# EAGLE design smartFridgeController (EAGLE 9.0.1)
CNAME: Smat Fridge Controller; CREVISION: 0.4; DESIGNER: greg.cope@gmail.com
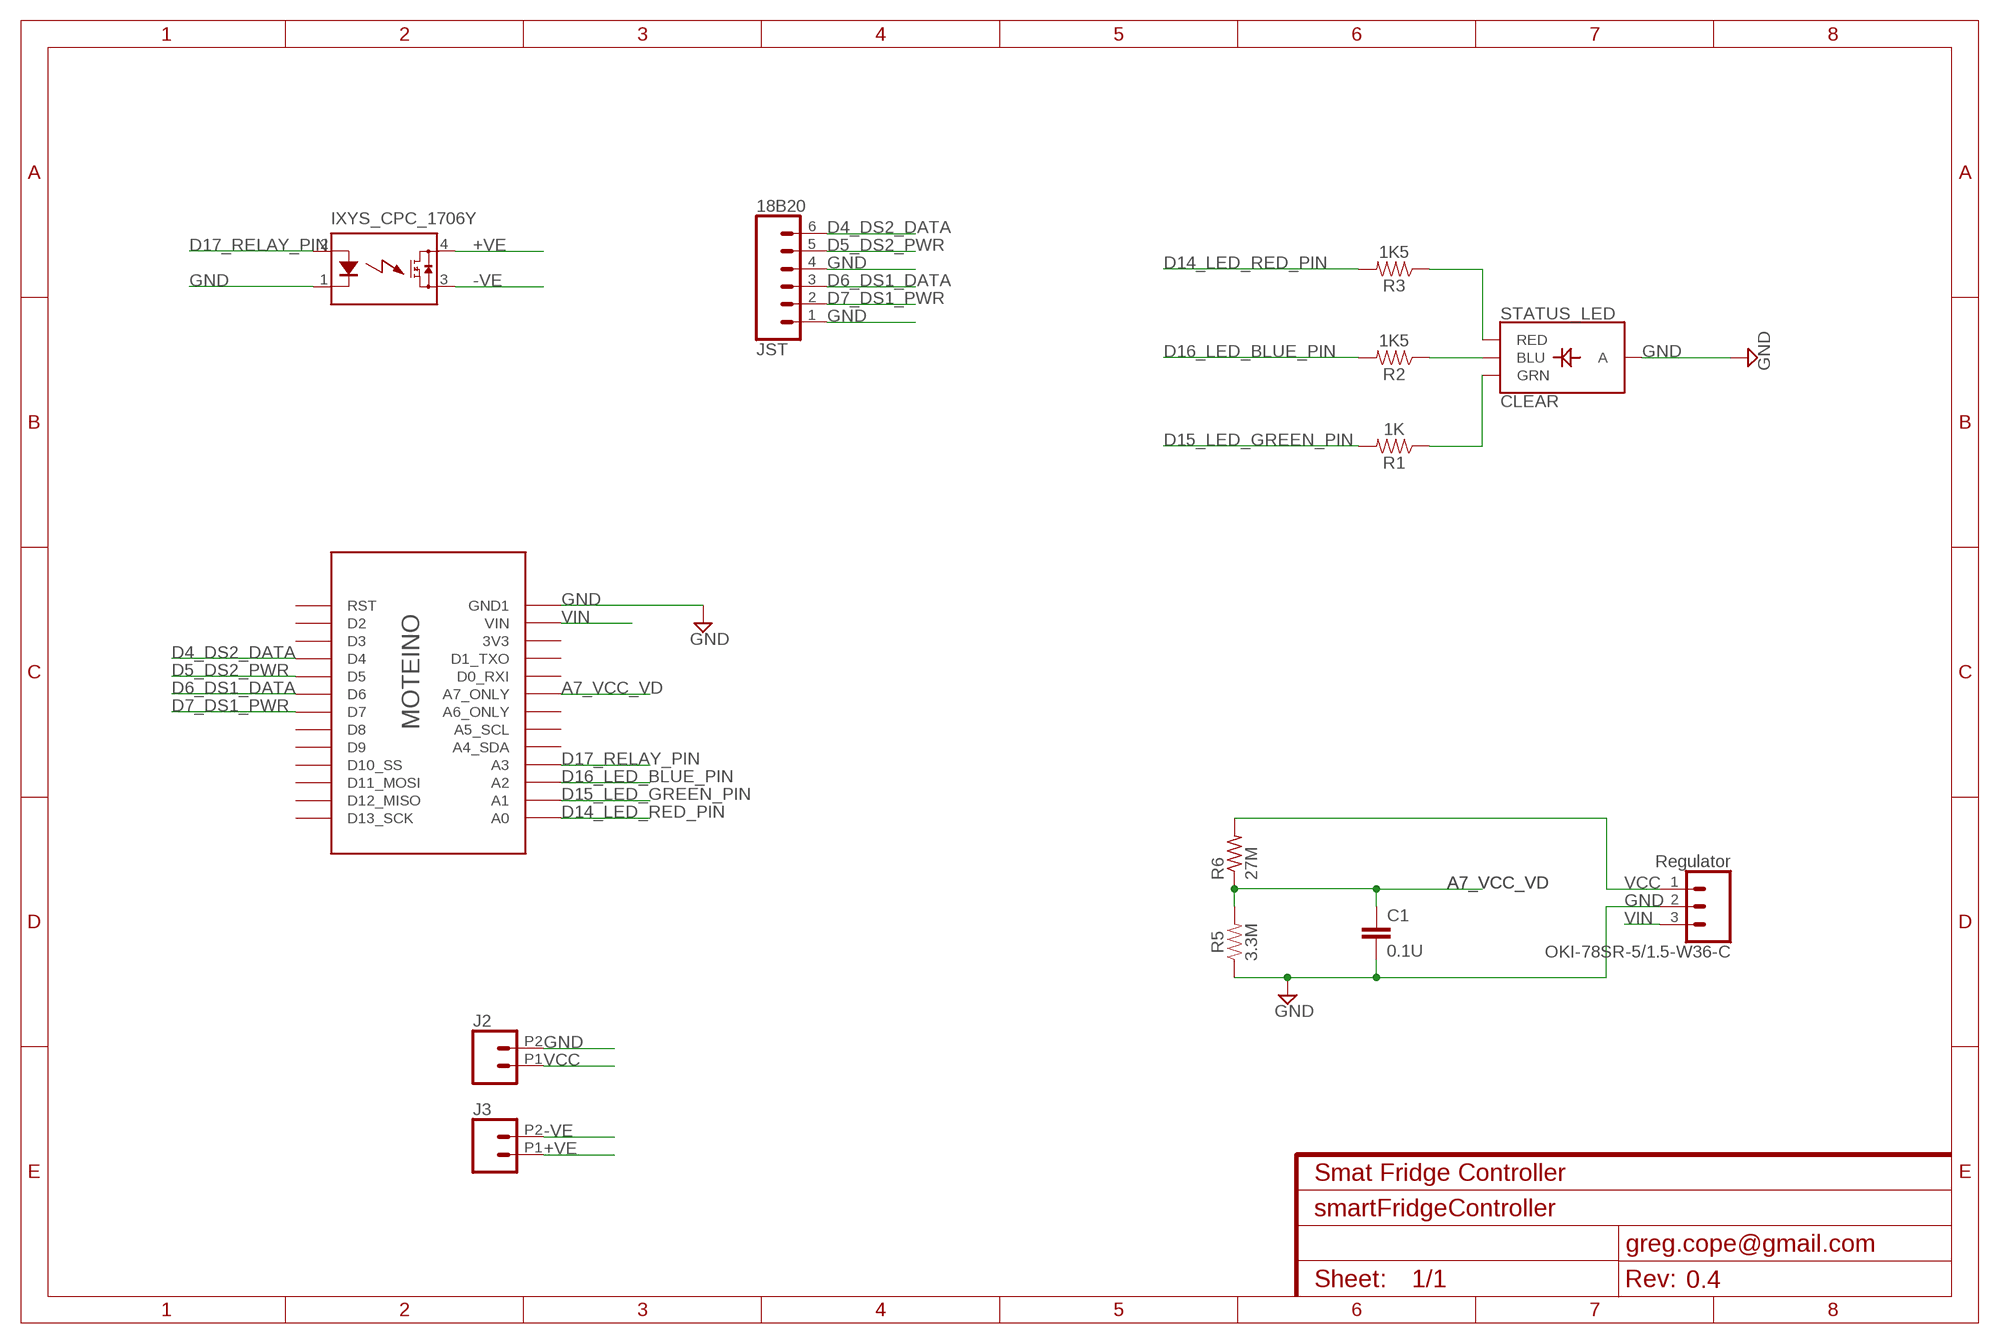
[diagram p0: schematic, sheet 1]

## Parts
18B20  JST  CONN_06SILK_FEMALE_PTH  [1X06]
C1  0.1U  0.1UF-KIT-EZ-50V-20%  [CAP-PTH-SMALL-KIT]
IXYS_CPC_1706Y  AQZ102D  [AQZ-SIL04]
J2  CONN_022.54MM_SCREWTERM  [1X02_2.54_SCREWTERM]
J3  CONN_022.54MM_SCREWTERM  [1X02_2.54_SCREWTERM]
OKI-78SR-5/1.5-W36-C  Regulator  CONN_03  [1X03]
R1  1K  1KOHM-HORIZ-1/4W-1%  [AXIAL-0.3]
R2  1K5  1KOHM-HORIZ-1/4W-1%  [AXIAL-0.3]
R3  1K5  1KOHM-HORIZ-1/4W-1%  [AXIAL-0.3]
R5  3.3M  1KOHM-HORIZ-1/4W-1%  [AXIAL-0.3]
R6  27M  R-US_0309/12  [0309/12]
STATUS_LED  CLEAR  LED-RGB-CACLEAR  [LED-RGB-THRU]
U$2  MOTEINO_SIMPLE  [MOTEINO_SIMPLE]

## Nets
+VE [power]: IXYS_CPC_1706Y.4(DS1) J3.P1
-VE [power]: IXYS_CPC_1706Y.3(DS2) J3.P2
A7_VCC_VD: C1.1 R5.P$2 R6.1 U$2.A7_ONLY
D4_DS2_DATA: 18B20.6 U$2.D4
D5_DS2_PWR: 18B20.5 U$2.D5
D6_DS1_DATA: 18B20.3 U$2.D6
D7_DS1_PWR: 18B20.2 U$2.D7
D14_LED_RED_PIN: R3.P$2 U$2.A0
D15_LED_GREEN_PIN: R1.P$2 U$2.A1
D16_LED_BLUE_PIN: R2.P$2 U$2.A2
D17_RELAY_PIN: IXYS_CPC_1706Y.2(A) U$2.A3
GND [power]: 18B20.1 18B20.4 C1.2 IXYS_CPC_1706Y.1(K) J2.P2 OKI-78SR-5/1.5-W36-C.2 R5.P$1 STATUS_LED.2(A) U$2.GND1
N$1: R3.P$1 STATUS_LED.1(RED)
N$2: R2.P$1 STATUS_LED.4(BLU)
N$3: R1.P$1 STATUS_LED.3(GRN)
VCC [power]: J2.P1 OKI-78SR-5/1.5-W36-C.1 R6.2
VIN [power]: OKI-78SR-5/1.5-W36-C.3 U$2.VIN
Unconnected: U$2.3V3 U$2.A4_SDA U$2.A5_SCL U$2.A6_ONLY U$2.D0_RXI U$2.D1_TXO U$2.D2 U$2.D3 U$2.D8 U$2.D9 U$2.D10_SS U$2.D11_MOSI U$2.D12_MISO U$2.D13_SCK U$2.RST

## Library data of the parts
18B20 = SparkFun-Connectors:CONN_06: Multi connection point. Often used as Generic Header-pin footprint for 0.1 inch spaced/style header connections On any of the 0.1 inch spaced packages, you can populate with these: Break Away Headers - Straight <https://www.sparkfun.com/products/116> (PRT-00116) Break Away Male Headers - Right Angle <https://www.sparkfun.com/products/553> (PRT-00553) Female Headers <https://www.sparkfun.com/products/115> (PRT-00115) Break Away Headers - Machine Pin <https://www.sparkfun.com/products/117> (PRT-00117) Break Away Female Headers - Swiss Machine Pin <https://www.sparkfun.com/products/743> (PRT-00743) Arduino Stackable Header - 6 Pin <https://www.sparkfun.com/products/9280> (PRT-09280) For SCREWTERMINALS and SPRING TERMINALS visit here: Screw Terimnals on SparkFun.com <https://www.sparkfun.com/search/results?term=Screw+Terminals> (5mm/3.5mm/2.54mm spacing) This device is also useful as a general connection point to wire up your design to another part of your project. Our various solder wires solder well into these plated through hole pads. Hook-Up Wire - Assortment (Stranded, 22 AWG) <https://www.sparkfun.com/products/11375> (PRT-11375) Hook-Up Wire - Assortment (Solid Core, 22 AWG) <https://www.sparkfun.com/products/11367> (PRT-11367) View the entire wire category on our website here <https://www.sparkfun.com/categories/141>; PROD_ID: CONN-08437
C1 = SparkFun-Capacitors:0.1UF: 0.1µF ceramic capacitors A capacitor is a passive two-terminal electrical component used to store electrical energy temporarily in an electric field.; PROD_ID: CAP-08370; VALUE: 0.1uF
IXYS_CPC_1706Y = relay:AQZ10*D: PhotoMOS Relay NAiS Source: http://www.panasonic-electric-works.com/catalogues/downloads/photomos/ds_x615_en_aqz10_20.pdf; MF: AROMAT/ MATSUSHITA; MPN: AQZ102D; OC_FARNELL: 1448345; OC_NEWARK: 10C4038
J2 J3 = SparkFun-Connectors:CONN_02: Multi connection point. Often used as Generic Header-pin footprint for 0.1 inch spaced/style header connections On any of the 0.1 inch spaced packages, you can populate with these: Break Away Headers - Straight <https://www.sparkfun.com/products/116> (PRT-00116) Break Away Male Headers - Right Angle <https://www.sparkfun.com/products/553> (PRT-00553) Female Headers <https://www.sparkfun.com/products/115> (PRT-00115) Break Away Headers - Machine Pin <https://www.sparkfun.com/products/117> (PRT-00117) Break Away Female Headers - Swiss Machine Pin <https://www.sparkfun.com/products/743> (PRT-00743) For SCREWTERMINALS and SPRING TERMINALS visit here: Screw Terimnals on SparkFun.com <https://www.sparkfun.com/search/results?term=Screw+Terminals> (5mm/3.5mm/2.54mm spacing) This device is also useful as a general connection point to wire up your design to another part of your project. Our various solder wires solder well into these plated through hole pads. Hook-Up Wire - Assortment (Stranded, 22 AWG) <https://www.sparkfun.com/products/11375> (PRT-11375) Hook-Up Wire - Assortment (Solid Core, 22 AWG) <https://www.sparkfun.com/products/11367> (PRT-11367) View the entire wire category on our website here <https://www.sparkfun.com/categories/141> Special notes: Molex polarized connector foot print use with: PRT-08233 with associated crimp pins and housings. 2.54_SCREWTERM for use with PRT-10571. 3.5mm Screw Terminal footprints for PRT-08084 5mm Screw Terminal footprints for use with PRT-08432
OKI-78SR-5/1.5-W36-C = SparkFun-Connectors:CONN_03: Multi connection point. Often used as Generic Header-pin footprint for 0.1 inch spaced/style header connections On any of the 0.1 inch spaced packages, you can populate with these: Break Away Headers - Straight <https://www.sparkfun.com/products/116> (PRT-00116) Break Away Male Headers - Right Angle <https://www.sparkfun.com/products/553> (PRT-00553) Female Headers <https://www.sparkfun.com/products/115> (PRT-00115) Break Away Headers - Machine Pin <https://www.sparkfun.com/products/117> (PRT-00117) Break Away Female Headers - Swiss Machine Pin <https://www.sparkfun.com/products/743> (PRT-00743) Stackable Header - 3 Pin (Female, 0.1") <https://www.sparkfun.com/products/13875> (PRT-13875) For SCREWTERMINALS and SPRING TERMINALS visit here: Screw Terimnals on SparkFun.com <https://www.sparkfun.com/search/results?term=Screw+Terminals> (5mm/3.5mm/2.54mm spacing) This device is also useful as a general connection point to wire up your design to another part of your project. Our various solder wires solder well into these plated through hole pads. Hook-Up Wire - Assortment (Stranded, 22 AWG) <https://www.sparkfun.com/products/11375> (PRT-11375) Hook-Up Wire - Assortment (Solid Core, 22 AWG) <https://www.sparkfun.com/products/11367> (PRT-11367) View the entire wire category on our website here <https://www.sparkfun.com/categories/141> Special notes: Molex polarized connector foot print use with SKU : PRT-08232 with associated crimp pins and housings.; PROD_ID: XXX-00000; VALUE: 455-1750-1-ND
R1-R3 R5 = SparkFun-Resistors:1KOHM: 1kΩ resistor A resistor is a passive two-terminal electrical component that implements electrical resistance as a circuit element. Resistors act to reduce current flow, and, at the same time, act to lower voltage levels within circuits. - Wikipedia; PROD_ID: RES-12182; VALUE: 1k
R6 = adafruit:R-US_: RESISTOR, American symbol
STATUS_LED = SparkFun-LED:LED-RGB-CA: LED-RGB Diffused Common Anode Packages: LED RGB-THRU P-LCC-4-3 LED-TRICOLOR-SMD SparkFun Products: RGB Diffused Common Anode- Diffuse <[https://www.sparkfun.com/products/10821]> RGB Diffused Common Anode - Clear <[https://www.sparkfun.com/products/10820]> Qduino Mini <[https://www.sparkfun.com/products/13614]> Triple Output LED RGB - SMD <https://www.sparkfun.com/products/7844>; PROD_ID: DIO-10631
U$2 = Moteino:MOTEINO_SIMPLE

## Net classes
0 default: width 0.254 mm, clearance 0.254 mm
1 power: width 0.61 mm, clearance 0.254 mm

## Board
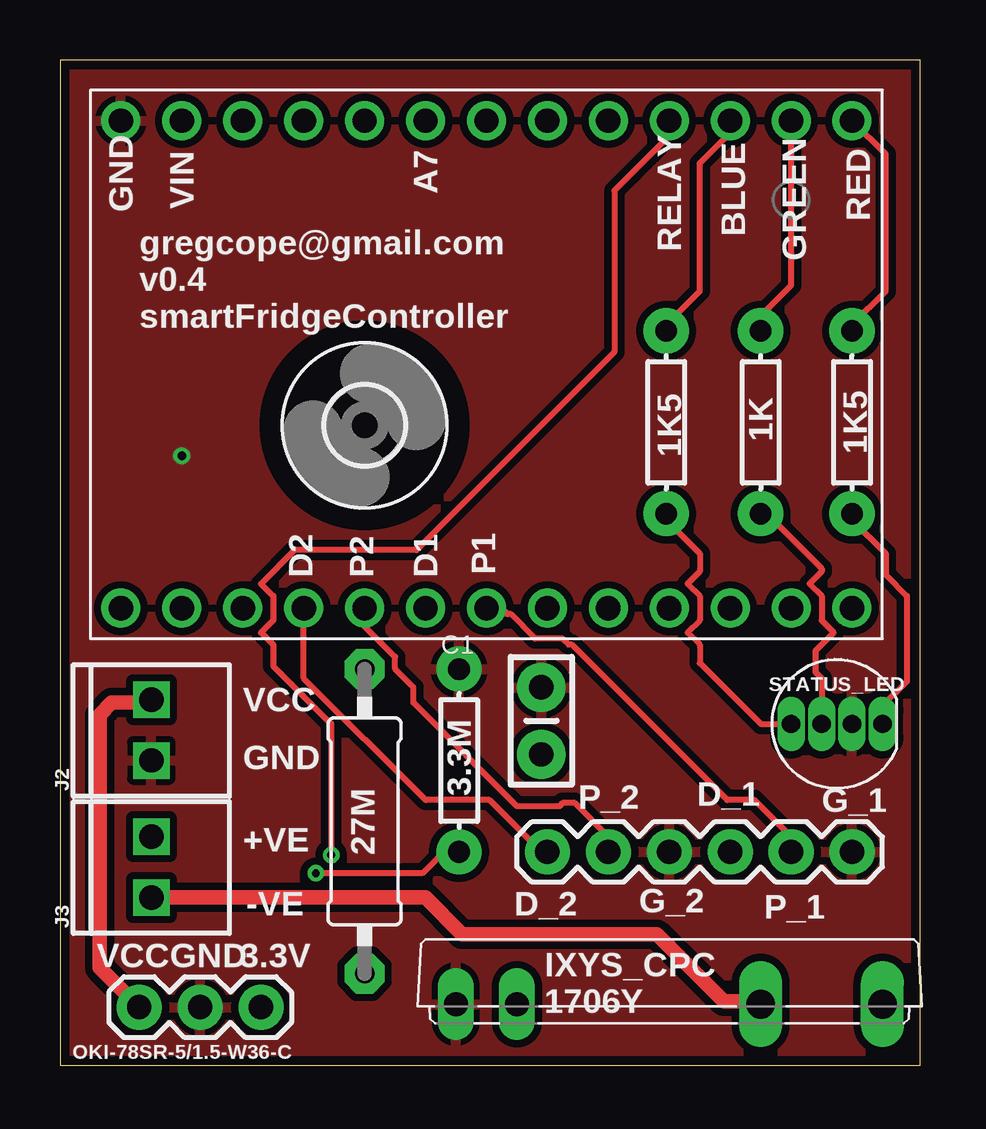
[diagram p1: board, top side]
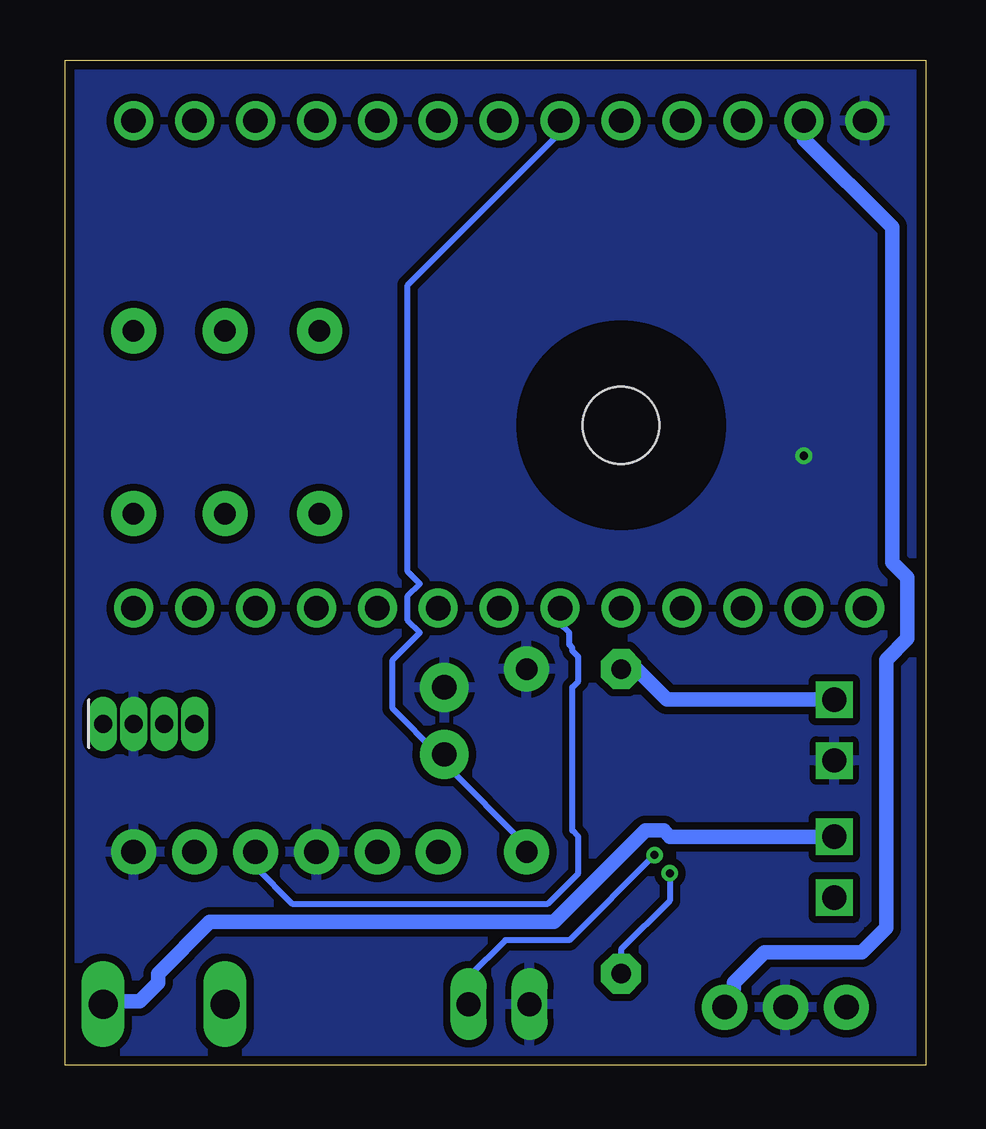
[diagram p2: board, bottom side, seen from below]

Size 35.87 x 41.9 mm. Coordinates in mm from the lower left corner, seen from the top.
Outline: 0,0 35.87,0 35.87,41.9 0,41.9 0,0
Copper layers (1*16): Top 0.0356mm / dielectric 1.5011mm / Bottom 0.0356mm
Design rules "oshpark-2layer": minimum track width 6mil, minimum drill 13mil, track to track 6mil, track to pad 6mil, pad to pad 6mil, via to via 6mil, smd to smd 6mil, copper to edge 15mil, drill to drill 6mil, minimum pad ring 7mil, minimum via ring 7mil, stop-mask expansion 2.5mil, vias tented up to drill 0mil, thermal gap 10mil

### Footprints (pad centres in the part's own frame; a part is rotated, then mirrored left to right if it is on the bottom)
1X06 = drill 1.016 pad 1.88: 1 0,0; 2 2.54,0; 3 5.08,0; 4 7.62,0; 5 10.16,0; 6 12.7,0
CAP-PTH-SMALL-KIT = drill 1.016 pad 2.032: 1 -1.397,0; 2 1.397,0
AQZ-SIL04 = drill 1 long: 1 -8.89,0; 2 -6.35,0 | drill 1.2 long: 3 3.81,0; 4 8.89,0
1X02_2.54_SCREWTERM = drill 1.016 square: P1 2.54,0; P2 0,0
1X03 = drill 1.016 pad 1.88: 1 0,0; 2 2.54,0; 3 5.08,0
AXIAL-0.3 = drill 0.9 pad 1.88: P$1 -3.81,0; P$2 3.81,0
0309/12 = drill 0.813 pad 1.676 octagon: 1 -6.35,0; 2 6.35,0
LED-RGB-THRU = drill 0.762 pad 0.889 long: 1 1.905,0; 2 0.635,0; 3 -0.635,0; 4 -1.905,0
MOTEINO_SIMPLE = drill 1.016 pad 1.626: 3V3 -10.16,10.16; A0 15.24,10.16; A1 12.7,10.16; A2 10.16,10.16; A3 7.62,10.16; A4_SDA 5.08,10.16; A5_SCL 2.54,10.16; A6_ONLY 0,10.16; A7_ONLY -2.54,10.16; D0_RXI -5.08,10.16; D1_TXO -7.62,10.16; D2 -12.7,-10.16; D3 -10.16,-10.16; D4 -7.62,-10.16; D5 -5.08,-10.16; D6 -2.54,-10.16; D7 0,-10.16; D8 2.54,-10.16; D9 5.08,-10.16; D10_SS 7.62,-10.16; D11_MOSI 10.16,-10.16; D12_MISO 12.7,-10.16; D13_SCK 15.24,-10.16; GND1 -15.24,10.16; RST -15.24,-10.16; VIN -12.7,10.16
3,2 = hole 3.2: 0,0

### Placement (x,y rotation side)
18B20  33.02,8.89 180 top
C1  20.07,14.35 90 top
IXYS_CPC_1706Y  25.4,2.54 0 top
J2  3.81,12.7 90 top
J3  3.81,6.98 90 top
OKI-78SR-5/1.5-W36-C  3.3,2.41 0 top
R1  29.21,26.8 90 top
R2  25.27,26.8 90 top
R3  33.02,26.8 90 top
R5  16.64,12.7 270 top
R6  12.7,10.16 90 top
STATUS_LED  32.38,14.22 0 top
U$2  17.78,29.21 0 top
U$3  [3,2]  12.7,26.67 0 top

### Tracks (layer width: path | path; a pad name or v marks a point on that pad's centre or on a via)
+VE
  Bottom 0.61: J3.P1 10.67,9.53 10.92,9.78 11.68,9.78 15.49,5.97 29.84,5.97 32,3.81 32,3.43 32.77,2.67 34.16,2.67 IXYS_CPC_1706Y.4
-VE
  Top 0.61: J3.P2 15.24,6.98 16.76,5.46 24.89,5.46 27.69,2.67 29.08,2.67 IXYS_CPC_1706Y.3
A7_VCC_VD  (via drill 0.33)
  Top 0.254: v10.67,8 15.11,8 16,8.89 R5.P$2
  Bottom 0.254: R6.1 12.7,4.83 10.67,6.86 v10.67,8 | U$2.A7_ONLY 15.24,38.86 21.59,32.51 21.59,20.57 21.08,20.07 21.59,19.56 21.59,18.54 21.08,18.03 22.22,16.89 22.22,14.86 20.32,12.95 C1.1 20.07,12.57 16.64,9.14 R5.P$2
D4_DS2_DATA
  Top 0.254: U$2.D4 10.16,16.13 15.24,11.05 17.91,11.05 20.07,8.89 18B20.6
D5_DS2_PWR
  Top 0.254: U$2.D5 12.7,18.29 13.97,17.02 13.97,16.51 14.73,15.75 14.73,15.11 19.05,10.79 20.83,10.79 20.95,10.92 21.46,10.92 22.86,9.53 18B20.5
D6_DS1_DATA
  Bottom 0.254: U$2.D6 15.24,18.42 14.86,18.03 14.86,17.53 14.73,17.4 14.73,17.27 14.48,17.02 14.48,16 14.73,15.75 14.73,9.78 14.48,9.53 14.48,8 15.75,6.73 26.42,6.73 27.94,8.25 18B20.3
D7_DS1_PWR
  Top 0.254: U$2.D7 18.41,19.05 18.67,18.8 18.8,18.8 19.81,17.78 20.95,17.78 21.21,17.53 21.34,17.53 27.81,11.05 28.96,11.05 30.48,9.53 18B20.2
D14_LED_RED_PIN
  Top 0.254: U$2.A0 34.42,37.97 34.42,32.26 33.02,30.86 R3.P$2
D15_LED_GREEN_PIN
  Top 0.254: U$2.A1 30.48,32.51 29.21,31.24 R1.P$2
D16_LED_BLUE_PIN
  Top 0.254: U$2.A2 27.94,38.86 26.67,37.59 26.67,32.26 25.27,30.86 R2.P$2
D17_RELAY_PIN  (via drill 0.33)
  Top 0.254: v11.3,8.76 11.3,14.22 8.89,16.64 8.89,17.53 8.38,18.03 8.89,18.54 8.89,19.56 8.38,20.07 9.78,21.46 14.86,21.46 23.11,29.72 23.11,36.45 25.4,38.73 U$2.A3
  Bottom 0.254: IXYS_CPC_1706Y.2 19.05,3.68 17.53,5.21 14.86,5.21 v11.3,8.76
GND  (via drill 0.35)
  other vias: 5.08,25.4
  pour Bottom (isolate 0.305): 0,41.91 35.56,41.91 35.69,0 0,0
  pour Top (isolate 0.305): 0,0 0,41.91 35.69,41.78 35.56,0
N$1
  Top 0.254: STATUS_LED.1 34.29,14.99 35.31,16 35.31,19.56 34.42,20.45 34.42,21.34 33.02,22.73 R3.P$1
N$2
  Top 0.254: STATUS_LED.4 29.21,14.22 26.67,16.76 26.67,17.53 26.16,18.03 26.67,18.54 26.67,19.56 26.16,20.07 26.67,20.57 26.67,21.34 25.27,22.73 R2.P$1
N$3
  Top 0.254: STATUS_LED.3 31.75,16.13 31.5,16.38 31.5,17.27 32.26,18.03 31.75,18.54 31.75,19.56 31.24,20.07 31.75,20.57 31.75,20.7 29.46,22.99 R1.P$1
VCC
  Top 0.61: OKI-78SR-5/1.5-W36-C.1 1.65,4.06 1.65,14.6 2.16,15.11 3.68,15.11 J2.P1
  Bottom 0.61: J2.P1 10.79,15.24 12.06,16.51 R6.2
VIN
  Bottom 0.61: U$2.VIN 5.08,38.61 1.4,34.92 1.4,20.96 0.76,20.32 0.76,17.78 1.65,16.89 1.65,5.71 2.67,4.7 6.73,4.7 8,3.43 8,3.18 8.38,2.79 OKI-78SR-5/1.5-W36-C.3

### Text on the board
tNames: A7 | GND | VIN | RED | RELAY | BLUE | GREEN | gregcope@gmail.com / v0.4 / smartFridgeController | D2 | P2 | D1 | P1 | C1 | VCC | GND | D_1 | P_2 | G_1 | +VE | -VE | D_2 | G_2 | P_1 | VCC | GND | 3.3V | IXYS_CPC / 1706Y